# EAGLE design radio (EAGLE 6.5.0)
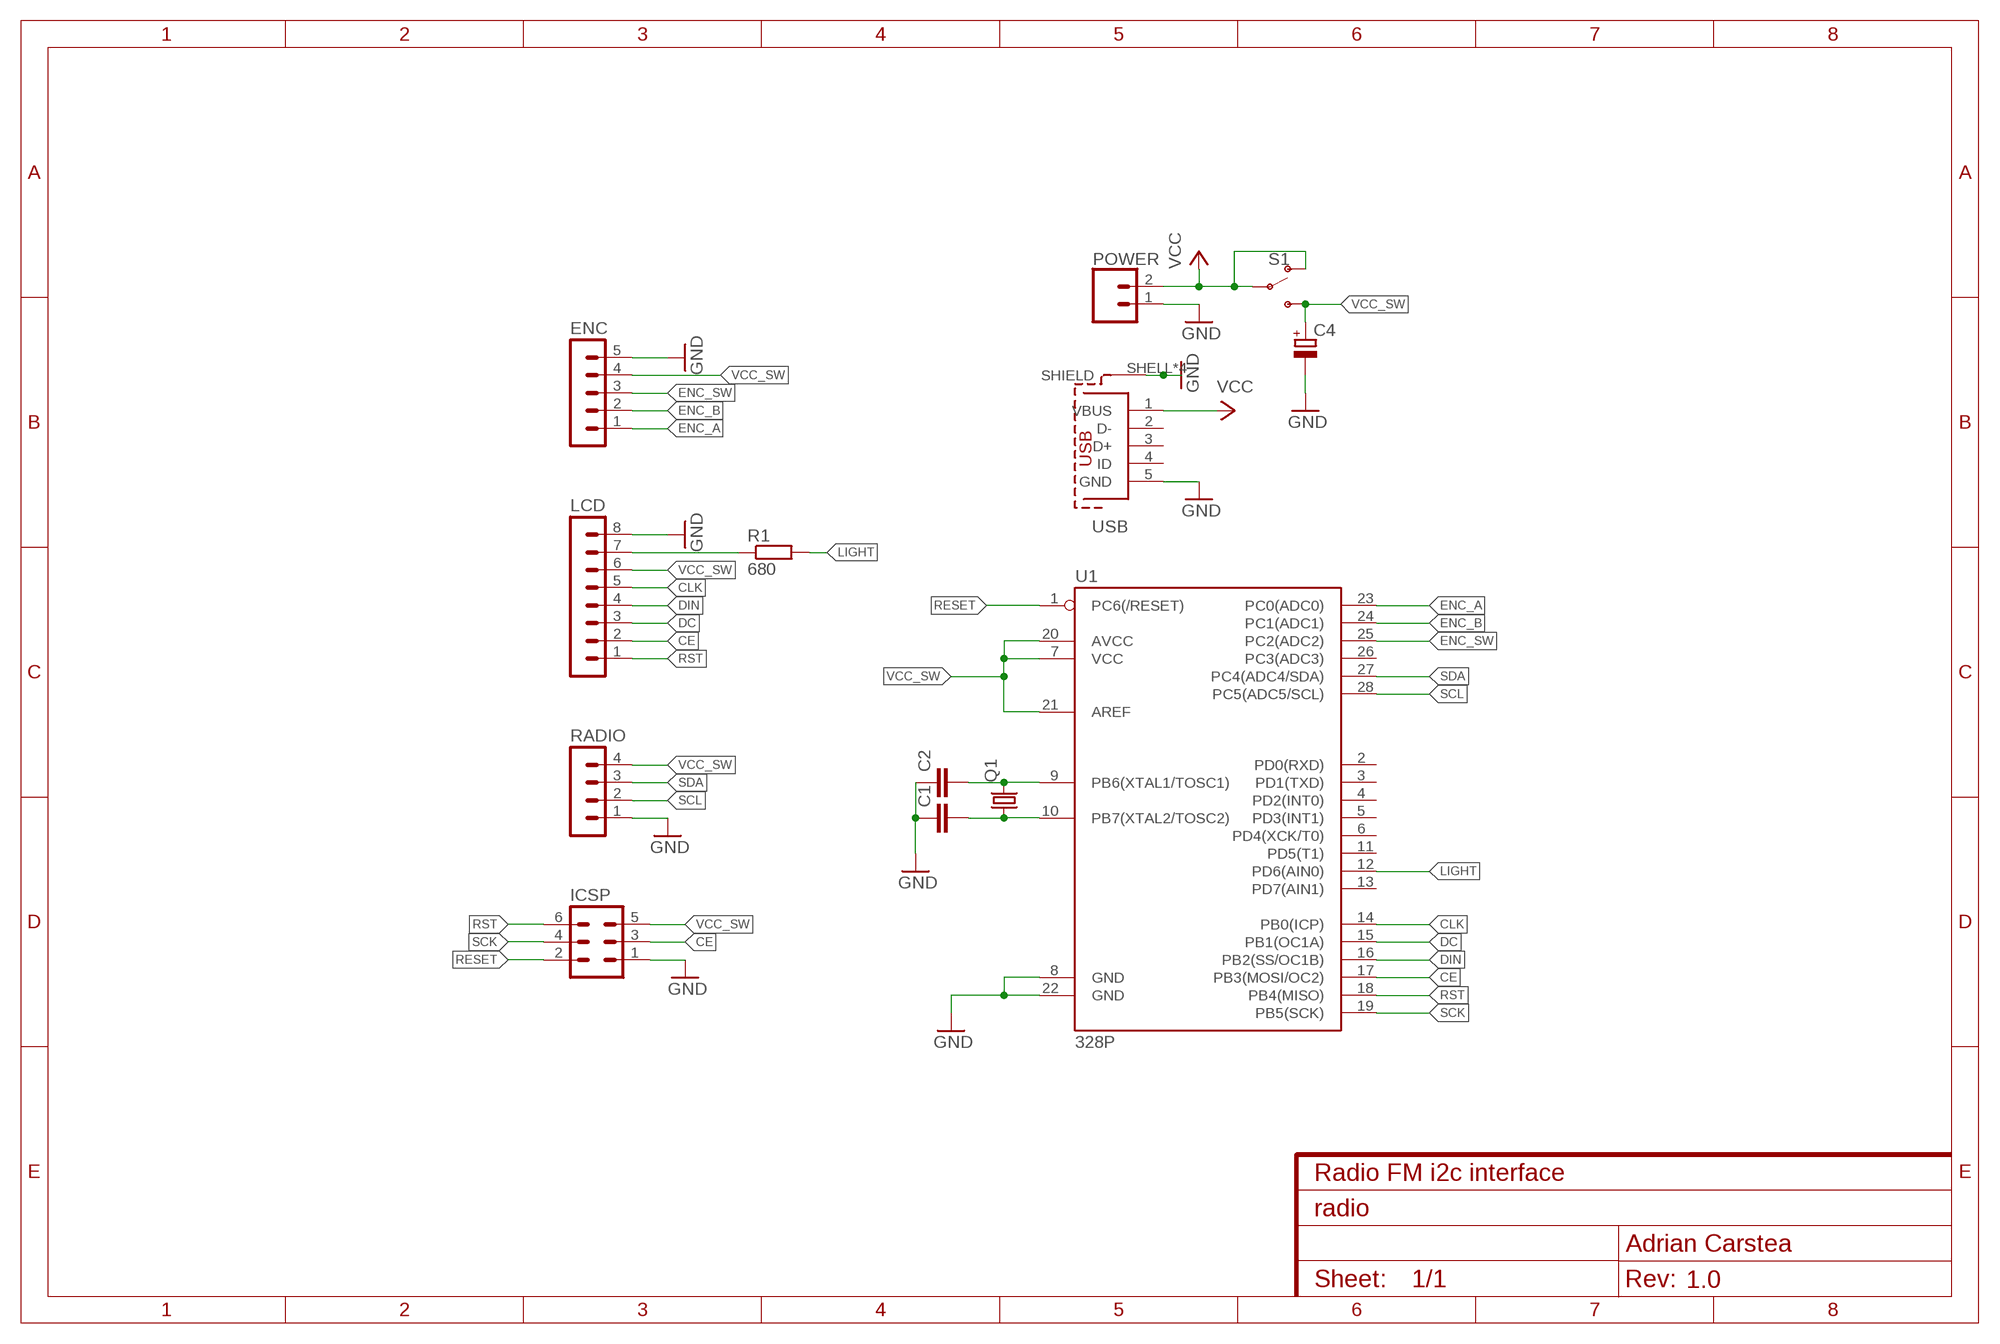
[diagram p0: schematic, sheet 1]
FRAME1 (FRAME-A4L): CNAME: Radio FM i2c interface; CREVISION: 1.0; DESIGNER: Adrian Carstea

## Parts
C1  C-EUC1206  [C1206]
C2  C-EUC1206  [C1206]
C4  CPOL-EUE5-10.5  [E5-10,5]
ENC  MA05-1  [MA05-1]
ICSP  MA03-2  [MA03-2]
LCD  MA08-1  [MA08-1]
POWER  CONN_02PTH3  [1X02_LONGPADS]
Q1  CRYSTALSM49  [SM49]
R1  680  R-EU_R0805  [R0805]
RADIO  MA04-1  [MA04-1]
S1  SWITCH-SPDT-PTH-11.6X4.0MM  [SWITCH_SPDT_PTH_11.6X4.0MM]
U1  328P  ATMEGA328P_PDIP  [DIP28]
USB  629105136821  [629105136821]

## Nets
CE: ICSP.3 LCD.2 U1.17(PB3(MOSI/OC2))
CLK: LCD.5 U1.14(PB0(ICP))
DC: LCD.3 U1.15(PB1(OC1A))
DIN: LCD.4 U1.16(PB2(SS/OC1B))
ENC_A: ENC.1 U1.23(PC0(ADC0))
ENC_B: ENC.2 U1.24(PC1(ADC1))
ENC_SW: ENC.3 U1.25(PC2(ADC2))
GND: C1.1 C2.1 C4.- ENC.5 ICSP.1 LCD.8 POWER.1 RADIO.1 U1.8(GND) U1.22(GND) USB.5(GND) USB.SHELL1(SHIELD) USB.SHELL2(SHIELD) USB.SHELL3(SHIELD) USB.SHELL(SHIELD)
LIGHT: R1.2 U1.12(PD6(AIN0))
N$1: C2.2 Q1.2 U1.9(PB6(XTAL1/TOSC1))
N$2: C1.2 Q1.1 U1.10(PB7(XTAL2/TOSC2))
N$5: LCD.7 R1.1
RESET: ICSP.2 U1.1(PC6(/RESET))
RST: ICSP.6 LCD.1 U1.18(PB4(MISO))
SCK: ICSP.4 U1.19(PB5(SCK))
SCL: RADIO.2 U1.28(PC5(ADC5/SCL))
SDA: RADIO.3 U1.27(PC4(ADC4/SDA))
VCC: POWER.2 S1.1(O) S1.2(P) USB.1(VBUS)
VCC_SW: C4.+ ENC.4 ICSP.5 LCD.6 RADIO.4 S1.3(S) U1.7(VCC) U1.20(AVCC) U1.21(AREF)
Unconnected: U1.2(PD0(RXD)) U1.3(PD1(TXD)) U1.4(PD2(INT0)) U1.5(PD3(INT1)) U1.6(PD4(XCK/T0)) U1.11(PD5(T1)) U1.13(PD7(AIN1)) U1.26(PC3(ADC3)) USB.2(D-) USB.3(D+) USB.4(ID)

## Library data of the parts
C1 C2 = rcl:C-EU: CAPACITOR, European symbol
C4 = rcl:CPOL-EU: POLARIZED CAPACITOR, European symbol
ENC = con-lstb:MA05-1: PIN HEADER; OC_FARNELL: unknown; OC_NEWARK: unknown
ICSP = con-lstb:MA03-2: PIN HEADER; OC_FARNELL: unknown; OC_NEWARK: unknown
LCD = con-lstb:MA08-1: PIN HEADER; OC_FARNELL: unknown; OC_NEWARK: unknown
POWER = SparkFun-Connectors:CONN_02: Multi connection point. Often used as Generic Header-pin footprint for 0.1 inch spaced/style header connections On any of the 0.1 inch spaced packages, you can populate with these: Break Away Headers - Straight <https://www.sparkfun.com/products/116> (PRT-00116) Break Away Male Headers - Right Angle <https://www.sparkfun.com/products/553> (PRT-00553) Female Headers <https://www.sparkfun.com/products/115> (PRT-00115) Break Away Headers - Machine Pin <https://www.sparkfun.com/products/117> (PRT-00117) Break Away Female Headers - Swiss Machine Pin <https://www.sparkfun.com/products/743> (PRT-00743) For SCREWTERMINALS and SPRING TERMINALS visit here: Screw Terimnals on SparkFun.com <https://www.sparkfun.com/search/results?term=Screw+Terminals> (5mm/3.5mm/2.54mm spacing) This device is also useful as a general connection point to wire up your design to another part of your project. Our various solder wires solder well into these plated through hole pads. Hook-Up Wire - Assortment (Stranded, 22 AWG) <https://www.sparkfun.com/products/11375> (PRT-11375) Hook-Up Wire - Assortment (Solid Core, 22 AWG) <https://www.sparkfun.com/products/11367> (PRT-11367) View the entire wire category on our website here <https://www.sparkfun.com/categories/141> Special notes: Molex polarized connector foot print use with: PRT-08233 with associated crimp pins and housings. 2.54_SCREWTERM for use with PRT-10571. 3.5mm Screw Terminal footprints for PRT-08084 5mm Screw Terminal footprints for use with PRT-08432
Q1 = crystal:CRYSTAL: CRYSTAL; OC_FARNELL: unknown; OC_NEWARK: unknown
R1 = rcl:R-EU_: RESISTOR, European symbol
RADIO = con-lstb:MA04-1: PIN HEADER; OC_FARNELL: unknown; OC_NEWARK: unknown
S1 = SparkFun-Switches:SWITCH-SPDT: Single Pole, Double Throw (SPDT) Switch Single-pole, double-throw (SPDT) switch. Variant Overview SMD-AYZ0202 Surface Mount DPDT Switch <https://www.sparkfun.com/products/597> (COM-00597) Used on e.g. LilyPad Arduino USB - ATmega32U4 Board <https://www.sparkfun.com/products/12049> PTH-11.6X4.0MM SPDT Mini Power Switch <https://www.sparkfun.com/products/102> (COM-00102) Used on e.g. SparkFun Simon Says - Through-Hole Soldering Kit <https://www.sparkfun.com/products/10547> (KIT-10547) PTH-11.6X4.0MM-KIT KIT version of SPDT Mini Power Switch - Simplifies soldering by removing tStop of switch pins - only one side can be soldered. PTH-11.6X4.0MM-LOCK LOCK version of SPDT Mini Power Switch - Offset pins hold switch in place for easier soldering. SMD-RIGHT-ANGLE Surface Mount Right Angle Switch <https://www.sparkfun.com/products/10860> (COM-10860) Used on e.g. SparkFun ESP8266 Thing <https://www.sparkfun.com/products/13231>; PROD_ID: SWCH-08261; SF_SKU: COM-00102
U1 = SparkFun-IC-Microcontroller:ATMEGA328P_PDIP: Atmel 328P Through hole ATMEGA328P uC used in the Arduino 32kb flash, 1k EEPROM, 2k SRAM Datasheet <http://www.sparkfun.com/datasheets/Components/SMD/ATMega328.pdf> SparkFun Products Storefront component: AVR 28 Pin 20MHz 32K 6A/D - ATMega328P <https://www.sparkfun.com/products/9061> (COM-09061) SparkFun Simon Says - Through-Hole Soldering Kit <https://www.sparkfun.com/products/10547> (KIT-10547) SparkFun Learn to Solder - Simon Says <https://www.sparkfun.com/products/13708> (KIT-13708) SparkFun BigTime Watch Kit <https://www.sparkfun.com/products/11734> (KIT-11734) SparkFun ClockIt <https://www.sparkfun.com/products/10930> (KIT-10930) SparkFun Serial Enabled LCD Kit <https://www.sparkfun.com/products/10097> (LCD-10097) SparkFun Simon Tilts - Through Hole Soldering Kit <https://www.sparkfun.com/products/12634> (KIT-12634) SparkFun Frequency Counter Kit <https://www.sparkfun.com/products/10140> (KIT-10140) FabFM Radio Kit <https://www.sparkfun.com/products/11043> (KIT-11043) SparkFun Binary Blaster Kit <https://www.sparkfun.com/products/12037> (KIT-12037) SparkFun Metro-Gnome <https://www.sparkfun.com/products/9236> (KIT-09236) ATmega328 with Arduino Optiboot (Uno) <https://www.sparkfun.com/products/10524> (DEV-10524); PROD_ID: IC-09136
USB = usb connector:629105136821: WR-COM SMT Horizontal 5 Contacts Micro USB Type B,5 pins=>Code : Con_I-O_COM_MicroUSB_629105136821 <http://katalog.we-online.de/media/images/eican/Con_I-O_COM_MicroUSB_629105136821_pf2.jpg> Details see: http://katalog.we-online.de/en/em/COM_MICRO_SMT_TYPE_B_HORIZONTAL/629105136821?m Created 2014-07-09, Karrer Zheng 2014 (C) Würth Elektronik

## Board
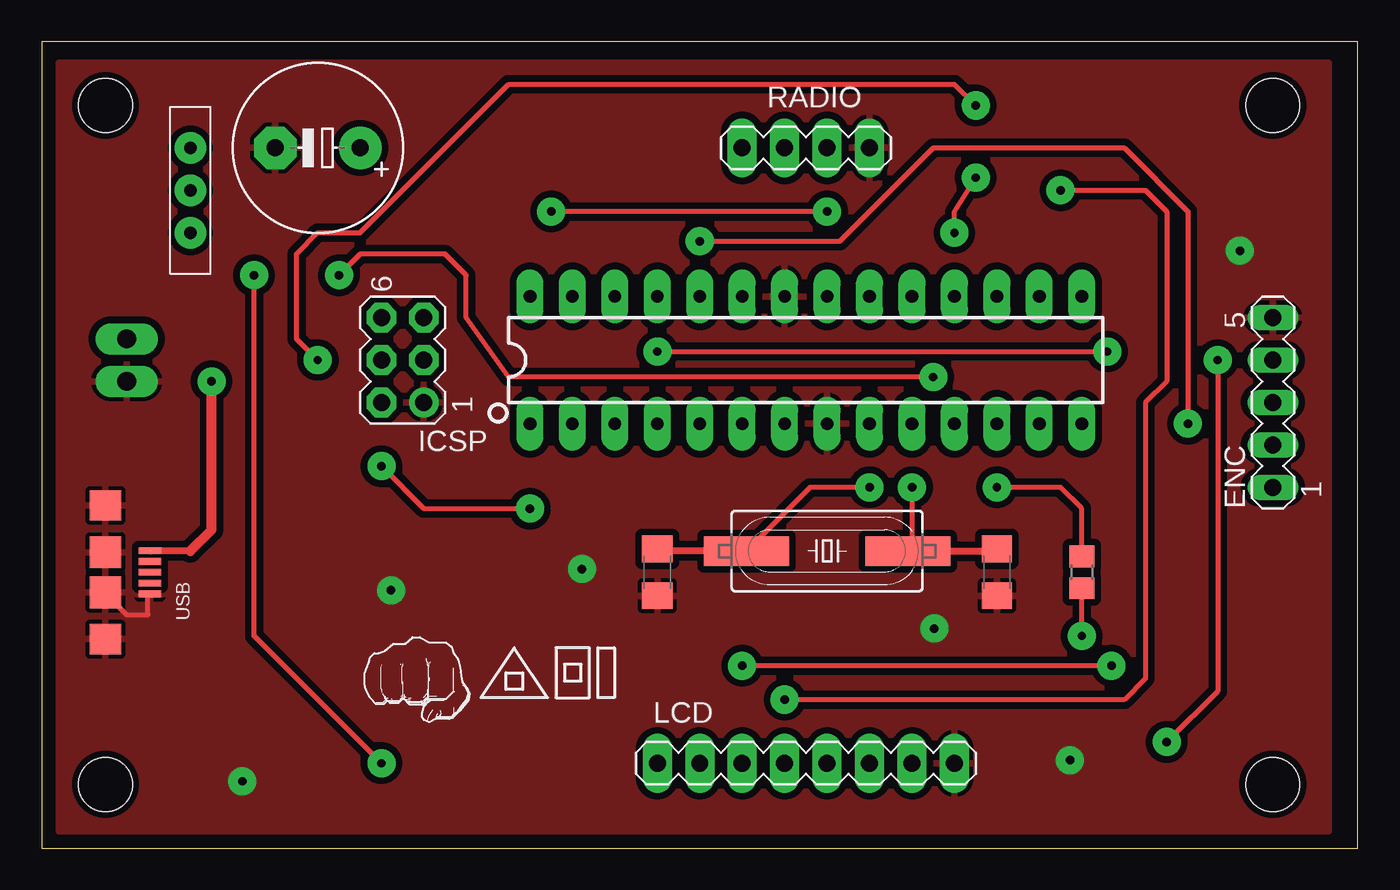
[diagram p1: board, top side]
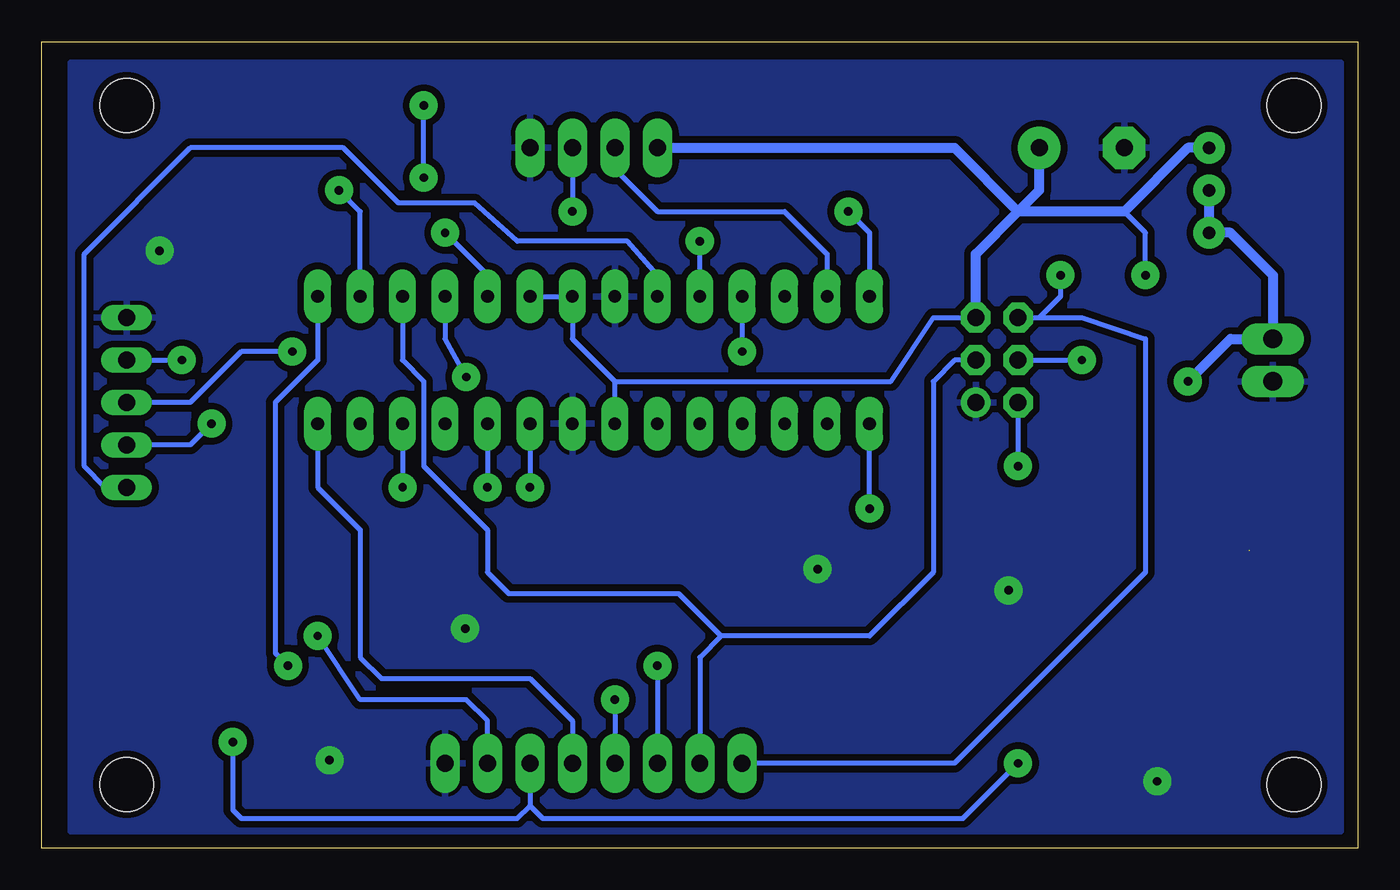
[diagram p2: board, bottom side, seen from below]

Size 78.74 x 48.26 mm. Coordinates in mm from the lower left corner, seen from the top.
Outline: 0,0 78.74,0 78.74,48.26 0,48.26 0,0
Copper layers (1*16): Top 0.0356mm / dielectric 1.5011mm / Bottom 0.0356mm
Design rules "oshpark-2layer *": minimum track width 6mil, minimum drill 13mil, track to track 6mil, track to pad 6mil, pad to pad 6mil, via to via 6mil, smd to smd 6mil, copper to edge 15mil, drill to drill 6mil, minimum pad ring 7mil, minimum via ring 7mil, stop-mask expansion 2.5mil, vias tented up to drill 20mil, thermal gap 10mil
Holes 3.2 mm at 3.81,3.81 3.81,44.45 73.66,44.45 73.66,3.81

### Footprints (pad centres in the part's own frame; a part is rotated, then mirrored left to right if it is on the bottom)
C1206 = smd 1.6 x 1.8: 1 -1.4,0; 2 1.4,0
E5-10,5 = drill 1.016 pad 2.54: + -2.54,0 | drill 1.016 pad 2.54 octagon: - 2.54,0
MA05-1 = drill 1.016 long: 1 -5.08,0; 2 -2.54,0; 3 0,0; 4 2.54,0; 5 5.08,0
MA03-2 = drill 1.016 pad 1.778: 1 -2.54,-1.27 | drill 1.016 pad 1.778 octagon: 2 -2.54,1.27; 3 0,-1.27; 4 0,1.27; 5 2.54,-1.27; 6 2.54,1.27
MA08-1 = drill 1.016 pad 1.778 long: 1 -8.89,0; 2 -6.35,0; 3 -3.81,0; 4 -1.27,0; 5 1.27,0; 6 3.81,0; 7 6.35,0; 8 8.89,0
1X02_LONGPADS = drill 1.118 pad 1.88 long: 1 0,0; 2 2.54,0
SM49 = smd 5.08 x 1.778: 1 -4.826,0; 2 4.826,0
R0805 = smd 1.3 x 1.5: 1 -0.95,0; 2 0.95,0
MA04-1 = drill 1.016 pad 1.778 long: 1 -3.81,0; 2 -1.27,0; 3 1.27,0; 4 3.81,0
SWITCH_SPDT_PTH_11.6X4.0MM = drill 0.762 pad 1.88: 1 0,2.54; 2 0,0; 3 0,-2.54
DIP28 = drill 0.762 pad 1.626 long: 1 -16.51,-3.81; 2 -13.97,-3.81; 3 -11.43,-3.81; 4 -8.89,-3.81; 5 -6.35,-3.81; 6 -3.81,-3.81; 7 -1.27,-3.81; 8 1.27,-3.81; 9 3.81,-3.81; 10 6.35,-3.81; 11 8.89,-3.81; 12 11.43,-3.81; 13 13.97,-3.81; 14 16.51,-3.81; 15 16.51,3.81; 16 13.97,3.81; 17 11.43,3.81; 18 8.89,3.81; 19 6.35,3.81; 20 3.81,3.81; 21 1.27,3.81; 22 -1.27,3.81; 23 -3.81,3.81; 24 -6.35,3.81; 25 -8.89,3.81; 26 -11.43,3.81; 27 -13.97,3.81; 28 -16.51,3.81
629105136821 = smd 0.4 x 1.35: 1 -1.3,2.675; 2 -0.65,2.675; 3 0,2.675; 4 0.65,2.675; 5 1.3,2.675 | smd 1.8 x 1.9: SHELL -4,0; SHELL3 4,0 | smd 1.9 x 1.9: SHELL1 -1.2,0; SHELL2 1.2,0

### Placement (x,y rotation side)
C1  57.15,16.51 90 top
C2  36.83,16.51 90 top
C4  16.51,41.91 180 top
ENC  73.66,26.67 90 top
ICSP  21.59,29.21 90 top
LCD  45.72,5.08 0 top
POWER  5.08,27.94 90 top
Q1  46.99,17.78 180 top
R1  62.23,16.51 90 top
RADIO  45.72,41.91 180 top
S1  8.89,39.37 180 top
U1  45.72,29.21 0 top
U$1  [ADILOGO]  27,9 0 top
USB  3.81,16.51 270 top

### Tracks (layer width: path | path; a pad name or v marks a point on that pad's centre or on a via)
CE
  Bottom 0.305: ICSP.3 24.13,29.21 25.4,27.94 25.4,16.51 29.21,12.7 38.1,12.7 | 38.1,12.7 39.37,11.43 LCD.2 | U1.17 57.15,29.21 55.88,27.94 55.88,22.86 52.07,19.05 52.07,16.51 50.8,15.24 40.64,15.24 38.1,12.7
CLK
  Bottom 0.305: U1.14 62.23,21.59 59.69,19.05 59.69,11.43 58.42,10.16 49.53,10.16 46.99,7.62 LCD.5
DC  (via drill 0.5 pad 1.68)
  Top 0.305: v64.01,10.92 v41.91,10.92
  Bottom 0.305: U1.15 62.23,29.21 64.77,26.67 64.77,11.68 v64.01,10.92 | v41.91,10.92 LCD.3
DIN  (via drill 0.5 pad 1.68)
  Top 0.305: v60.96,39.37 66.04,39.37 67.31,38.1 67.31,27.94 66.04,26.67 66.04,10.16 64.77,8.89 v44.45,8.89
  Bottom 0.305: U1.16 59.69,38.1 v60.96,39.37 | v44.45,8.89 LCD.4
ENC_A
  Bottom 0.305: ENC.1 74.93,21.59 76.2,22.86 76.2,35.56 69.85,41.91 60.71,41.91 57.4,38.61 52.83,38.61 50.29,36.32 43.69,36.32 41.91,34.29 U1.23
ENC_B  (via drill 0.5 pad 1.68)
  Top 0.305: v68.58,25.4 68.58,38.1 64.77,41.91 53.34,41.91 47.75,36.32 v39.37,36.32
  Bottom 0.305: U1.24 v39.37,36.32 | v68.58,25.4 69.85,24.13 ENC.2
ENC_SW  (via drill 0.5 pad 1.68)
  Top 0.305: v36.83,29.72 v63.75,29.72
  Bottom 0.305: U1.25 v36.83,29.72 | v63.75,29.72 66.8,29.72 69.85,26.67 ENC.3
GND  (via drill 0.5 pad 1.68)
  Top 0.305: USB.SHELL2 3.81,15.24 5.08,13.97 6.35,13.97 6.35,15.07 USB.5
  other vias: 12,4 32.32,16.7 61.53,5.27 71.69,35.75 20.89,15.43 53.4,13.14
  pour Bottom (isolate 0.4): 1,1 1,47 77,47 77,1
  pour Top (isolate 0.4): 1,1 1,47 77,47 77,1
LIGHT  (via drill 0.5 pad 1.68)
  Top 0.305: R1.2 62.23,20.32 60.96,21.59 v57.15,21.59
  Bottom 0.305: U1.12 v57.15,21.59
N$1  (via drill 0.5 pad 1.68)
  Top 0.305: v49.53,21.59 45.97,21.59 Q1.2
  Top 0.406: Q1.2 36.83,17.78 C2.2
  Bottom 0.305: U1.9 v49.53,21.59
N$2  (via drill 0.5 pad 1.68)
  Top 0.305: v52.07,21.59 52.07,18.03
  Top 0.406: C1.2 57.15,17.78 Q1.1 52.07,18.03
  Bottom 0.305: U1.10 v52.07,21.59
N$5  (via drill 0.5 pad 1.68)
  Top 0.305: v62.23,12.7 R1.1
  Bottom 0.305: LCD.7 52.07,7.62 53.34,8.89 59.69,8.89 v62.23,12.7
RESET  (via drill 0.5 pad 1.68)
  Top 0.305: v20.32,22.86 22.86,20.32 v29.21,20.32
  Bottom 0.305: ICSP.2 v20.32,22.86 | v29.21,20.32 U1.1
RST  (via drill 0.5 pad 1.68)
  Top 0.305: v53.34,28.19 27.94,28.19 25.4,31.75 25.4,34.29 24.13,35.56 19.05,35.56 v17.78,34.29
  Bottom 0.305: ICSP.6 19.05,31.75 | 19.05,31.75 16.51,31.75 12.7,30.48 12.7,16.51 24.13,5.08 LCD.1 | U1.18 54.61,30.48 v53.34,28.19 | v17.78,34.29 17.78,33.02 19.05,31.75
SCK  (via drill 0.5 pad 1.68)
  Top 0.305: v54.61,36.83 54.61,38.1 v55.88,40.13 | v16.51,29.21 15.24,30.48 15.24,35.56 16.51,36.83 19.05,36.83 27.94,45.72 54.61,45.72 v55.88,44.45
  Bottom 0.305: U1.19 52.07,34.29 v54.61,36.83 | v55.88,40.13 v55.88,44.45 | ICSP.4 v16.51,29.21
SCL  (via drill 0.5 pad 1.68)
  Top 0.305: v46.99,38.1 v30.48,38.1
  Bottom 0.305: RADIO.2 v46.99,38.1 | v30.48,38.1 29.21,36.83 U1.28
SDA
  Bottom 0.305: RADIO.3 44.45,40.64 41.91,38.1 34.29,38.1 31.75,35.56 U1.27
VCC  (via drill 0.5 pad 1.68)  (1 unrouted)
  Top 0.406: 8.89,17.78 6.51,17.78
  Top 0.61: 8.89,17.78 10.16,19.05 v10.16,27.94
  Bottom 0.61: v10.16,27.94 7.62,30.48 POWER.2 5.08,34.29 7.62,36.83 S1.1 S1.2
VCC_SW  (via drill 0.5 pad 1.68)
  Top 0.305: v20.32,5.08 12.7,12.7 v12.7,34.29 | v70.36,29.21 70.36,9.4 v67.31,6.35
  Bottom 0.305: 44.45,27.94 46.99,30.48 U1.21 U1.20 | U1.7 44.45,27.94 | 44.45,27.94 27.94,27.94 25.4,31.75 ICSP.5 | LCD.6 49.53,2.54 | 49.53,2.54 48.77,1.78 23.62,1.78 v20.32,5.08 | v12.7,34.29 12.7,36.83 13.97,38.1 | ENC.4 v70.36,29.21 | v67.31,6.35 67.31,2.29 66.8,1.78 50.29,1.78 49.53,2.54
  Bottom 0.61: ICSP.5 22.86,35.56 20.32,38.1 | RADIO.4 24.13,41.91 20.32,38.1 | S1.3 10.16,41.91 13.97,38.1 20.32,38.1 | 20.32,38.1 19.05,39.37 C4.+